# EAGLE design Enclosure 100x68 PBLPI (EAGLE 9.6.2)
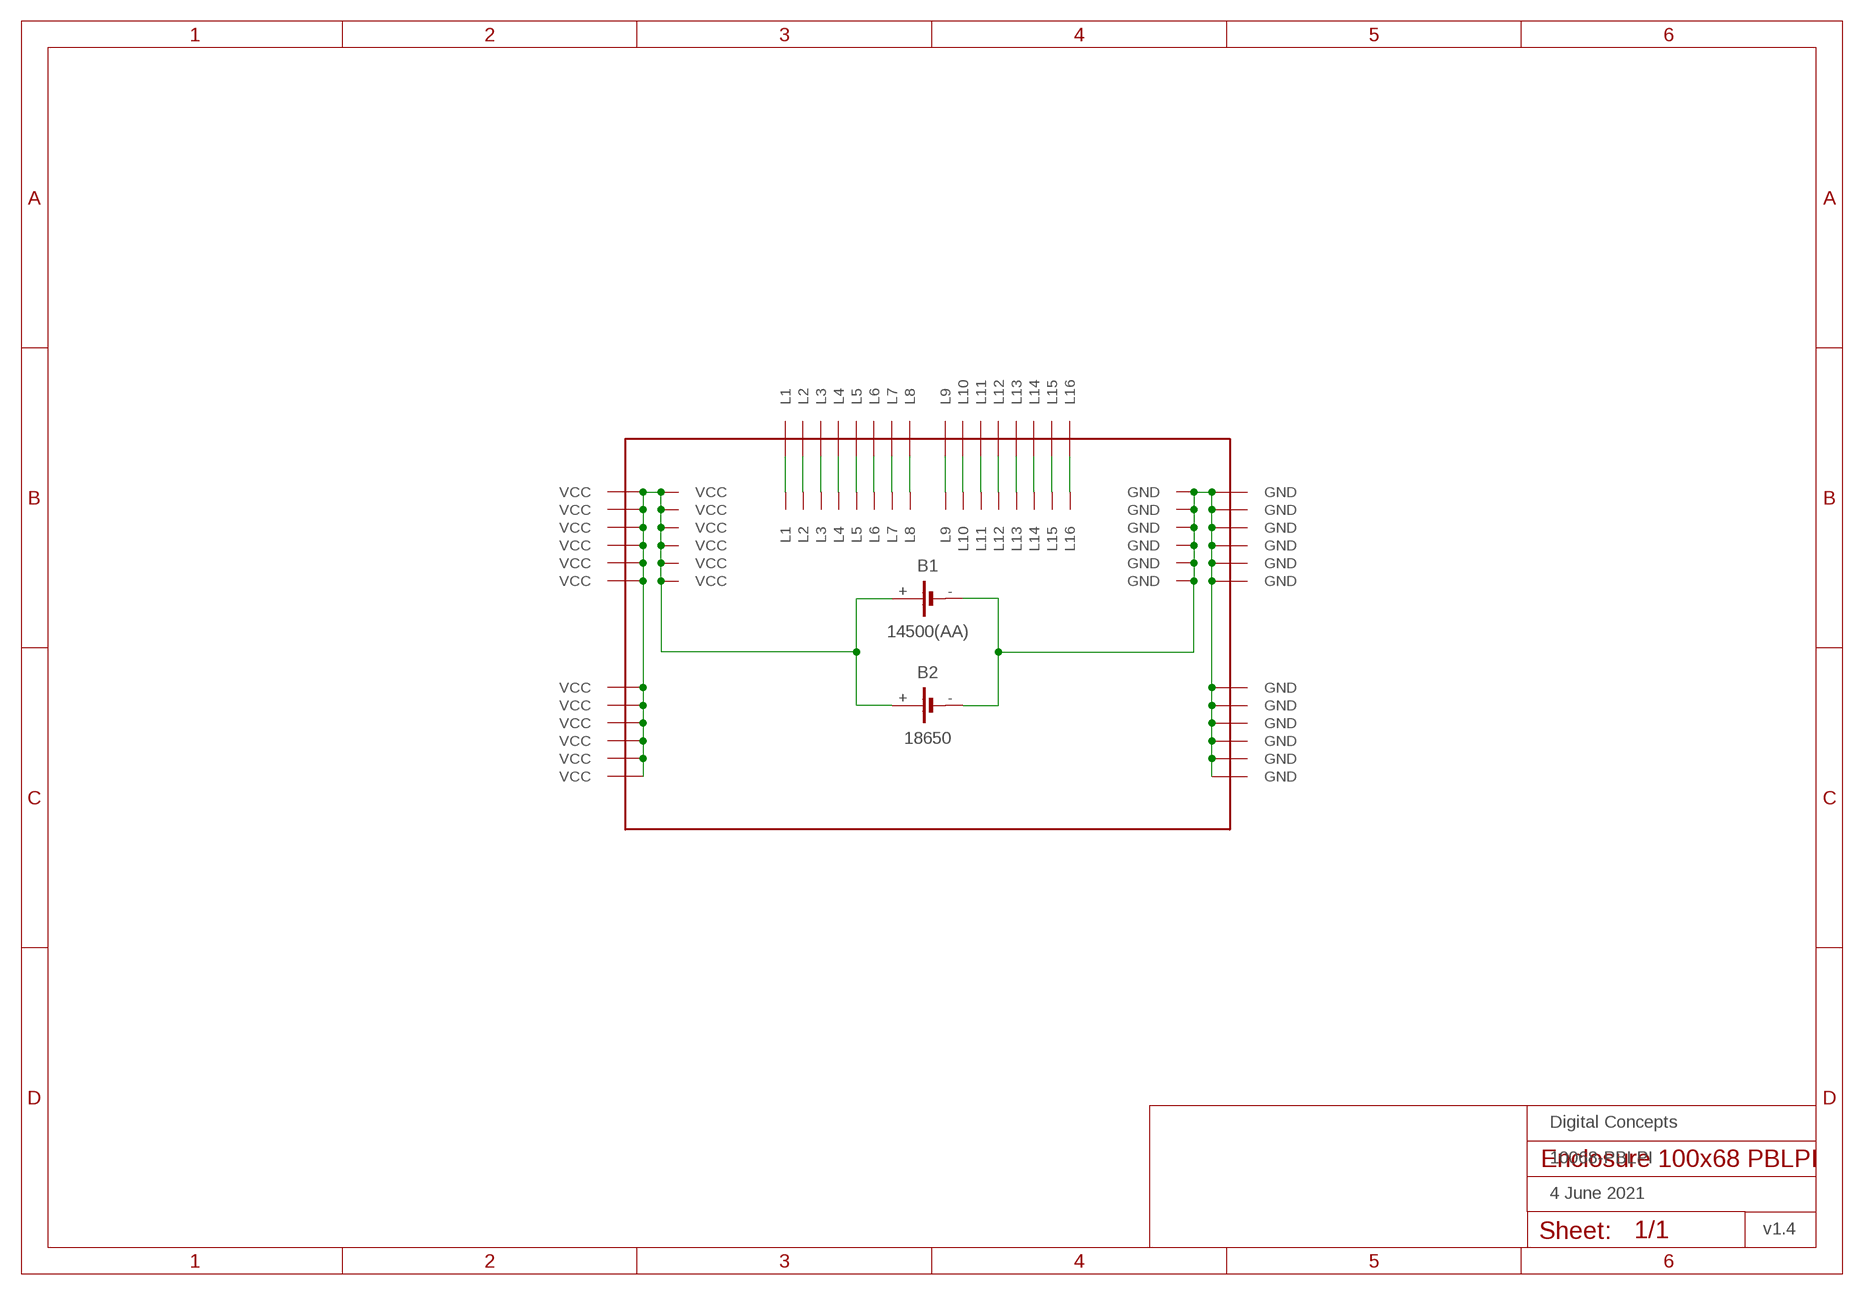
[diagram p0: schematic, sheet 1]
FRAME1 (FRAME-A4L-LOC): DATE: 4 June 2021; OWNER: Digital Concepts; TITLE: 10068-PBLPI; VERSION: v1.4

## Parts
B1  14500(AA)  BATTERY-HOLDER-14500(AA)  [BATTERY-14500]
B2  18650  BATTERY-HOLDER-18650  [BATTERY-18650]
P1  PROTO-34X22-BAT-PI  [PROTO-34X22-BAT-PI]

## Nets
GND: B1.- B2.- P1.P33-13(GND) P1.P33-14(GND) P1.P33-15(GND) P1.P33-16(GND) P1.P33-17(GND) P1.P33-18(GND) P1.P34-05(GND) P1.P34-06(GND) P1.P34-07(GND) P1.P34-08(GND) P1.P34-09(GND) P1.P34-10(GND) P1.P34-13(GND) P1.P34-14(GND) P1.P34-15(GND) P1.P34-16(GND) P1.P34-17(GND) P1.P34-18(GND)
N$1: P1.P10-21(L1) P1.P10-22(L1)
N$2: P1.P11-21(L2) P1.P11-22(L2)
N$3: P1.P12-21(L3) P1.P12-22(L3)
N$4: P1.P13-21(L4) P1.P13-22(L4)
N$5: P1.P14-21(L5) P1.P14-22(L5)
N$6: P1.P15-21(L6) P1.P15-22(L6)
N$7: P1.P16-21(L7) P1.P16-22(L7)
N$8: P1.P17-21(L8) P1.P17-22(L8)
N$9: P1.P18-21(L9) P1.P18-22(L9)
N$10: P1.P19-21(L10) P1.P19-22(L10)
N$11: P1.P20-21(L11) P1.P20-22(L11)
N$12: P1.P21-21(L12) P1.P21-22(L12)
N$13: P1.P22-21(L13) P1.P22-22(L13)
N$14: P1.P23-21(L14) P1.P23-22(L14)
N$15: P1.P24-21(L15) P1.P24-22(L15)
N$16: P1.P25-21(L16) P1.P25-22(L16)
VCC: B1.+ B2.+ P1.P01-05(VCC) P1.P01-06(VCC) P1.P01-07(VCC) P1.P01-08(VCC) P1.P01-09(VCC) P1.P01-10(VCC) P1.P01-13(VCC) P1.P01-14(VCC) P1.P01-15(VCC) P1.P01-16(VCC) P1.P01-17(VCC) P1.P01-18(VCC) P1.P02-13(VCC) P1.P02-14(VCC) P1.P02-15(VCC) P1.P02-16(VCC) P1.P02-17(VCC) P1.P02-18(VCC)

## Library data of the parts
B1 = digitalconcepts:BATTERY-HOLDER-14500(AA): 14500 (AA) battery holder
B2 = digitalconcepts:BATTERY-HOLDER-18650: 18650 Battery Holder
P1 = digitalconcepts:PROTO-34X22-BAT-PI: 34 x 22 Prototyping board, with battery connection (GND + Vcc plane), coupled side connection and Raspberry Pi Zero standoff mounting points, to fit a 100 x 68 enclosure

## Board
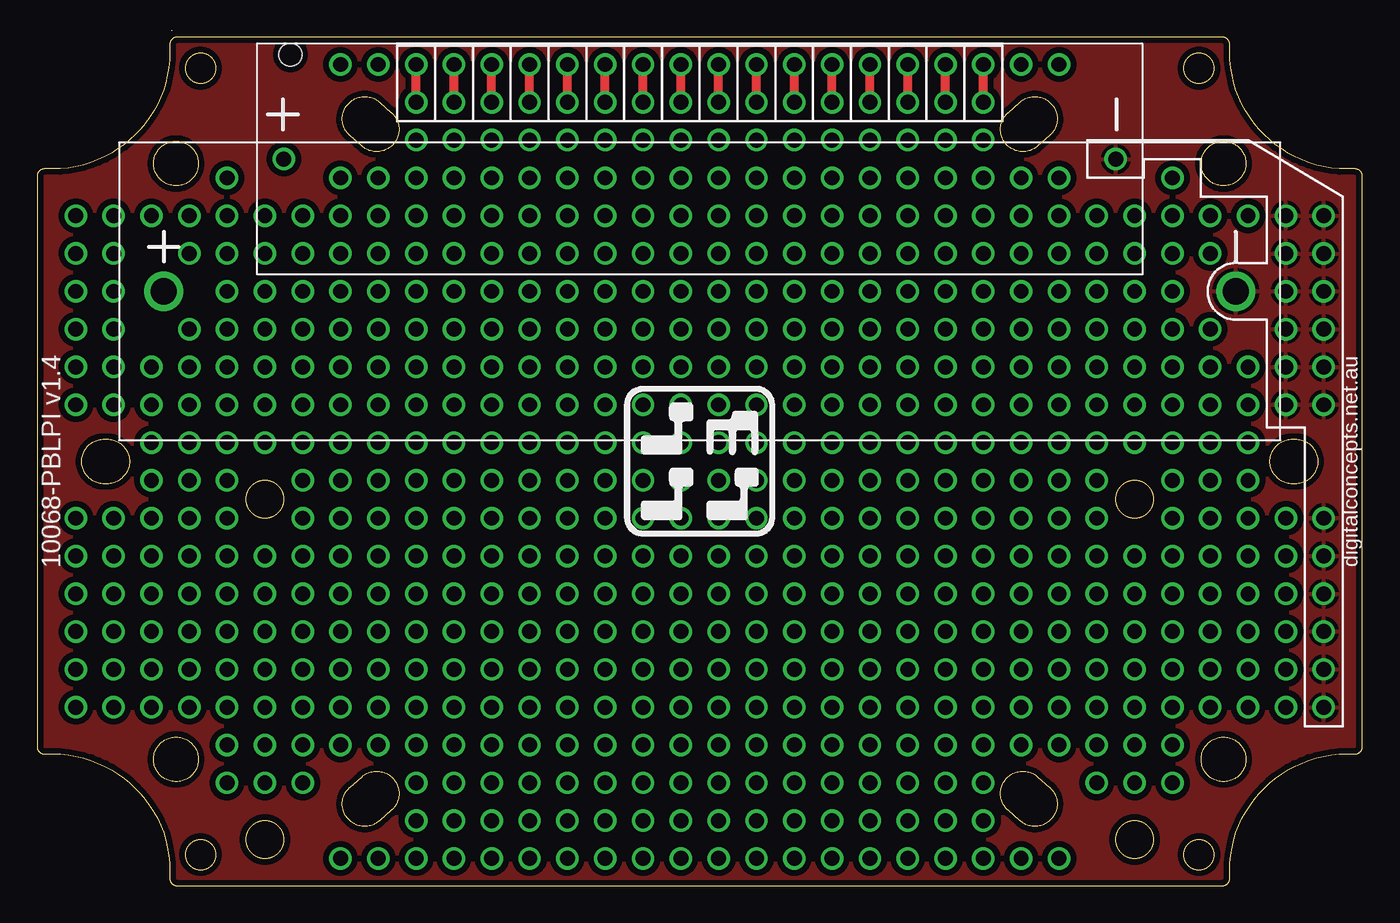
[diagram p1: board, top side]
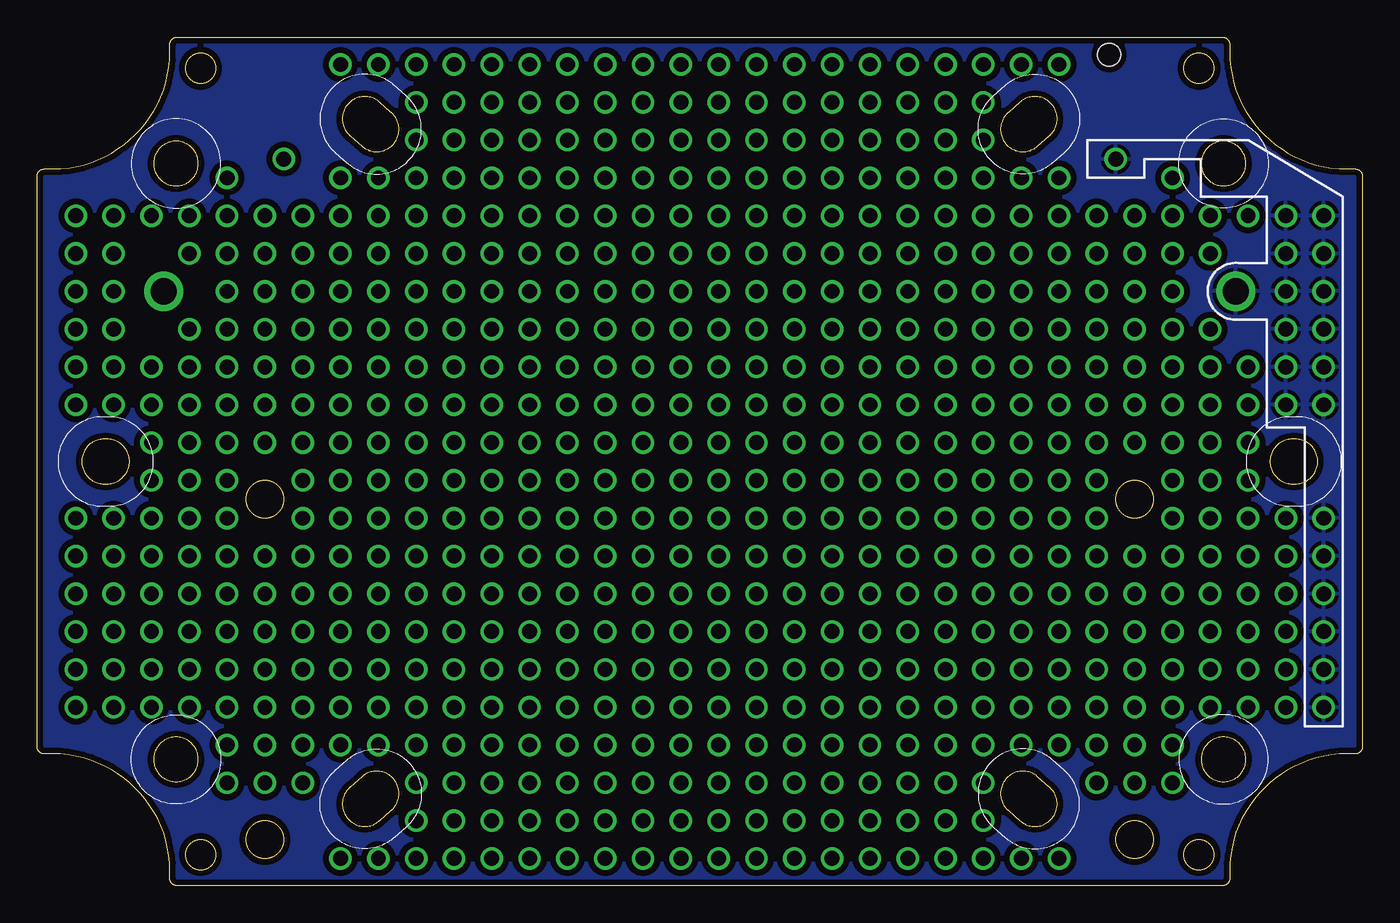
[diagram p2: board, bottom side, seen from below]

Size 89 x 57 mm. Coordinates in mm from the lower left corner, seen from the top.
Outline: 23.78,51.94 22.98,52.64 22.98,52.64 22.94,52.68 22.89,52.72 22.83,52.76 22.75,52.81 22.67,52.86 22.58,52.89 22.49,52.93 22.4,52.96 22.3,52.98 22.2,53 22.1,53.01 21.89,53.01 21.79,53 21.69,52.98 21.6,52.96 21.5,52.93 21.41,52.89 21.32,52.86 21.24,52.81 21.16,52.76 21.08,52.7 21,52.64 20.93,52.57 20.87,52.5 20.81,52.43 20.75,52.35 20.7,52.27 20.65,52.19 20.61,52.1 20.58,52.01 20.55,51.91 20.53,51.81 20.51,51.72 20.5,51.62 20.5,51.41 20.51,51.31 20.53,51.21 20.55,51.11 20.58,51.02 20.61,50.93 20.65,50.84 20.7,50.75 20.75,50.67 20.81,50.59 20.87,50.52 20.93,50.45 20.96,50.43 20.98,50.41 21.01,50.38 21.01,50.38 21.81,49.68 21.81,49.68 21.86,49.64 21.91,49.6 21.96,49.57 22.04,49.51 22.12,49.47 22.21,49.43 22.3,49.39 22.4,49.36 22.49,49.34 22.59,49.32 22.69,49.31 22.9,49.31 23,49.32 23.1,49.34 23.2,49.36 23.29,49.39 23.38,49.43 23.47,49.47 23.55,49.51 23.63,49.57 23.71,49.62 23.79,49.68 23.86,49.75 23.92,49.82 23.99,49.89 24.04,49.97 24.09,50.05 24.14,50.14 24.18,50.23 24.22,50.32 24.25,50.41 24.26,50.51 24.28,50.61 24.3,50.71 24.3,50.92 24.28,51.02 24.26,51.11 24.25,51.21 24.22,51.31 24.18,51.4 24.14,51.48 24.09,51.57 24.04,51.65 23.99,51.73 23.92,51.8 23.83,51.9 23.81,51.92 23.78,51.94
Outline: 23.78,51.94 23.78,51.94
Outline: 23.78,5.06 23.81,5.08 23.83,5.1 23.86,5.13 23.92,5.19 23.99,5.27 24.04,5.35 24.09,5.43 24.14,5.51 24.18,5.6 24.22,5.69 24.25,5.79 24.27,5.88 24.29,5.98 24.3,6.08 24.3,6.29 24.29,6.39 24.27,6.49 24.25,6.59 24.22,6.68 24.18,6.77 24.14,6.86 24.09,6.95 24.04,7.03 23.99,7.11 23.92,7.18 23.86,7.25 23.79,7.32 23.71,7.38 23.63,7.43 23.55,7.49 23.47,7.53 23.38,7.57 23.29,7.61 23.2,7.64 23.1,7.66 23,7.68 22.9,7.69 22.69,7.69 22.59,7.68 22.49,7.66 22.4,7.64 22.3,7.61 22.21,7.57 22.12,7.53 22.04,7.49 21.96,7.43 21.91,7.4 21.86,7.36 21.81,7.32 21.81,7.32 21.01,6.62 21.01,6.61 20.98,6.59 20.96,6.57 20.93,6.55 20.87,6.48 20.81,6.41 20.75,6.33 20.7,6.25 20.65,6.16 20.61,6.07 20.58,5.98 20.55,5.89 20.53,5.79 20.51,5.69 20.5,5.59 20.5,5.38 20.51,5.28 20.55,5.09 20.58,4.99 20.61,4.9 20.65,4.81 20.7,4.73 20.75,4.65 20.81,4.57 20.87,4.49 20.93,4.43 21,4.36 21.08,4.3 21.16,4.24 21.24,4.19 21.32,4.14 21.41,4.1 21.5,4.07 21.6,4.04 21.69,4.02 21.79,4 21.89,3.99 22.1,3.99 22.2,4 22.3,4.02 22.4,4.04 22.49,4.07 22.58,4.1 22.67,4.14 22.75,4.19 22.83,4.24 22.89,4.28 22.94,4.32 22.98,4.36 22.98,4.36 23.78,5.06
Outline: 23.78,5.06 23.78,5.06
Outline: 67.99,6.62 67.19,7.32 67.19,7.32 67.14,7.36 67.09,7.4 67.04,7.43 66.96,7.49 66.88,7.53 66.79,7.57 66.7,7.61 66.6,7.64 66.51,7.66 66.41,7.68 66.31,7.69 66.1,7.69 66,7.68 65.9,7.66 65.8,7.64 65.71,7.61 65.62,7.57 65.53,7.53 65.44,7.49 65.36,7.43 65.29,7.38 65.21,7.32 65.14,7.25 65.07,7.18 65.01,7.11 64.96,7.03 64.91,6.95 64.86,6.86 64.82,6.77 64.78,6.68 64.75,6.59 64.73,6.49 64.71,6.39 64.7,6.29 64.7,6.08 64.71,5.98 64.73,5.89 64.75,5.79 64.78,5.69 64.82,5.6 64.86,5.51 64.91,5.43 64.96,5.35 65.01,5.27 65.07,5.19 65.14,5.13 65.17,5.1 65.19,5.08 65.22,5.06 65.22,5.06 66.02,4.36 66.02,4.36 66.07,4.32 66.11,4.28 66.17,4.24 66.25,4.19 66.33,4.14 66.42,4.1 66.51,4.07 66.6,4.04 66.7,4.02 66.8,4 66.9,3.99 67.11,3.99 67.21,4 67.31,4.02 67.4,4.04 67.5,4.07 67.59,4.1 67.68,4.14 67.76,4.19 67.84,4.24 67.92,4.3 68,4.36 68.06,4.43 68.13,4.49 68.19,4.57 68.25,4.65 68.3,4.73 68.35,4.81 68.39,4.9 68.42,4.99 68.45,5.09 68.47,5.19 68.49,5.28 68.5,5.38 68.5,5.59 68.49,5.69 68.47,5.79 68.45,5.89 68.42,5.98 68.39,6.07 68.35,6.16 68.3,6.25 68.25,6.33 68.19,6.41 68.13,6.48 68.06,6.55 68.04,6.57 68.02,6.59 67.99,6.62
Outline: 67.99,6.62 67.99,6.62
Outline: 88.99,47.76 88.98,47.79 88.97,47.83 88.96,47.86 88.95,47.88 88.93,47.91 88.92,47.94 88.9,47.96 88.88,47.99 88.86,48.01 88.83,48.03 88.81,48.05 88.78,48.07 88.76,48.09 88.73,48.1 88.7,48.12 88.67,48.13 88.64,48.14 88.61,48.14 88.57,48.15 88.54,48.15 87.46,48.15 86.93,48.21 86.42,48.31 85.9,48.42 85.4,48.57 84.93,48.77 84.46,48.97 84.01,49.22 83.59,49.5 83.17,49.78 82.77,50.1 82.42,50.46 82.06,50.81 81.74,51.2 81.45,51.62 81.17,52.04 80.92,52.49 80.52,53.43 80.37,53.92 80.26,54.43 80.15,54.94 80.1,55.47 80.1,56.54 80.1,56.58 80.09,56.61 80.08,56.64 80.07,56.67 80.06,56.7 80.05,56.73 80.03,56.76 80.02,56.78 80,56.81 79.98,56.83 79.96,56.86 79.93,56.88 79.91,56.9 79.88,56.92 79.86,56.93 79.83,56.95 79.8,56.96 79.77,56.97 79.74,56.98 79.7,56.99 79.67,57 79.64,57 9.36,57 9.33,57 9.3,56.99 9.26,56.98 9.23,56.97 9.2,56.96 9.17,56.95 9.14,56.93 9.12,56.92 9.09,56.9 9.07,56.88 9.02,56.83 9,56.81 8.98,56.78 8.97,56.76 8.95,56.73 8.94,56.7 8.93,56.67 8.92,56.64 8.91,56.61 8.9,56.58 8.9,56.54 8.9,55.47 8.84,54.94 8.74,54.43 8.63,53.92 8.48,53.43 8.28,52.96 8.08,52.49 7.83,52.04 7.55,51.62 7.26,51.2 6.94,50.81 6.58,50.46 6.22,50.1 5.83,49.78 5.41,49.5 4.99,49.22 4.54,48.97 4.07,48.77 3.59,48.57 3.1,48.42 2.58,48.31 2.07,48.21 1.54,48.15 0.46,48.15 0.43,48.15 0.39,48.14 0.36,48.14 0.33,48.13 0.3,48.12 0.27,48.1 0.24,48.09 0.22,48.07 0.19,48.05 0.17,48.03 0.14,48.01 0.12,47.99 0.1,47.96 0.08,47.94 0.07,47.91 0.05,47.88 0.04,47.86 0.03,47.83 0.02,47.79 0.01,47.76 0,47.73 0,47.7 0,9.3 0,9.27 0.01,9.24 0.02,9.2 0.03,9.17 0.04,9.14 0.05,9.11 0.07,9.09 0.08,9.06 0.1,9.03 0.12,9.01 0.14,8.99 0.17,8.97 0.19,8.95 0.22,8.93 0.24,8.91 0.27,8.9 0.3,8.88 0.33,8.87 0.36,8.86 0.39,8.85 0.43,8.85 0.46,8.84 1.54,8.84 2.07,8.79 2.58,8.68 3.1,8.58 3.59,8.43 4.07,8.23 4.54,8.03 4.99,7.78 5.41,7.5 5.83,7.22 6.22,6.9 6.58,6.54 6.94,6.19 7.26,5.8 7.55,5.38 7.83,4.96 8.08,4.51 8.28,4.04 8.48,3.57 8.63,3.08 8.74,2.57 8.84,2.06 8.9,1.53 8.9,0.46 8.9,0.42 8.91,0.39 8.92,0.36 8.93,0.33 8.94,0.3 8.95,0.27 8.97,0.24 8.98,0.22 9,0.19 9.02,0.17 9.04,0.14 9.07,0.12 9.09,0.1 9.12,0.08 9.14,0.07 9.17,0.05 9.2,0.04 9.23,0.03 9.26,0.02 9.29,0.01 9.33,0 9.36,0 79.64,0 79.67,0 79.7,0.01 79.74,0.02 79.77,0.03 79.8,0.04 79.83,0.05 79.86,0.07 79.88,0.08 79.91,0.1 79.93,0.12 79.96,0.14 79.98,0.17 80,0.19 80.02,0.22 80.03,0.24 80.05,0.27 80.06,0.3 80.07,0.33 80.08,0.36 80.09,0.39 80.1,0.42 80.1,0.46 80.1,1.53 80.15,2.06 80.26,2.57 80.37,3.08 80.52,3.57 80.92,4.51 81.17,4.96 81.45,5.38 81.74,5.8 82.06,6.19 82.42,6.54 82.77,6.9 83.17,7.22 83.59,7.5 84.01,7.78 84.46,8.03 84.93,8.23 85.4,8.43 85.9,8.58 86.42,8.68 86.93,8.79 87.46,8.84 88.54,8.84 88.57,8.85 88.61,8.85 88.64,8.86 88.67,8.87 88.7,8.88 88.73,8.9 88.76,8.91 88.78,8.93 88.81,8.95 88.83,8.97 88.86,8.99 88.88,9.01 88.9,9.04 88.92,9.06 88.93,9.09 88.95,9.12 88.96,9.15 88.97,9.17 88.98,9.21 88.99,9.24 89,9.27 89,9.3 89,47.7 89,47.73 88.99,47.76
Outline: 6.16,28.2 6.14,28.1 6.12,28.01 6.08,27.92 6.04,27.83 5.99,27.74 5.94,27.66 5.88,27.58 5.82,27.51 5.76,27.44 5.69,27.37 5.61,27.31 5.53,27.26 5.45,27.2 5.37,27.16 5.28,27.12 5.19,27.08 5.09,27.05 5,27.03 4.9,27.01 4.8,27 4.39,27 4.29,27.01 4.19,27.03 4.09,27.05 4,27.08 3.91,27.12 3.82,27.16 3.74,27.2 3.66,27.26 3.58,27.31 3.5,27.37 3.43,27.44 3.37,27.51 3.3,27.58 3.25,27.66 3.2,27.74 3.15,27.83 3.11,27.92 3.07,28.01 3.04,28.1 3.02,28.2 3.01,28.3 2.99,28.4 2.99,28.6 3.01,28.7 3.02,28.8 3.04,28.9 3.07,28.99 3.15,29.17 3.2,29.26 3.25,29.34 3.3,29.42 3.37,29.49 3.43,29.56 3.5,29.63 3.58,29.69 3.66,29.74 3.74,29.8 3.82,29.84 3.91,29.88 4,29.92 4.09,29.95 4.19,29.97 4.29,29.99 4.39,30 4.8,30 4.9,29.99 5,29.97 5.09,29.95 5.19,29.92 5.28,29.88 5.37,29.84 5.45,29.8 5.53,29.74 5.61,29.69 5.69,29.63 5.76,29.56 5.82,29.49 5.88,29.42 5.94,29.34 5.99,29.26 6.04,29.17 6.08,29.08 6.12,28.99 6.14,28.9 6.16,28.8 6.18,28.7 6.19,28.6 6.19,28.4 6.18,28.3 6.16,28.2
Outline: 10.79,8.18 10.77,8.09 10.74,7.99 10.7,7.9 10.66,7.81 10.62,7.73 10.56,7.65 10.51,7.57 10.45,7.49 10.38,7.42 10.31,7.36 10.24,7.3 10.16,7.24 10.08,7.19 9.99,7.14 9.9,7.1 9.81,7.06 9.72,7.03 9.62,7.01 9.53,6.99 9.42,6.98 9.22,6.98 9.12,6.99 9.02,7.01 8.92,7.03 8.83,7.06 8.74,7.1 8.65,7.14 8.56,7.19 8.48,7.24 8.4,7.3 8.33,7.36 8.26,7.42 8.19,7.49 8.13,7.57 8.08,7.65 8.02,7.73 7.98,7.81 7.94,7.9 7.9,7.99 7.87,8.09 7.85,8.18 7.83,8.28 7.82,8.38 7.82,8.59 7.83,8.69 7.85,8.79 7.87,8.88 7.9,8.98 7.94,9.07 7.98,9.16 8.02,9.24 8.08,9.32 8.13,9.4 8.19,9.48 8.26,9.55 8.33,9.61 8.4,9.67 8.48,9.73 8.56,9.78 8.65,9.83 8.74,9.87 8.83,9.9 8.92,9.93 9.02,9.95 9.12,9.97 9.22,9.98 9.42,9.98 9.53,9.97 9.62,9.95 9.72,9.93 9.81,9.9 9.9,9.87 9.99,9.83 10.08,9.78 10.16,9.73 10.24,9.67 10.31,9.61 10.38,9.55 10.45,9.48 10.51,9.4 10.56,9.32 10.62,9.24 10.66,9.16 10.7,9.07 10.74,8.98 10.77,8.88 10.79,8.79 10.81,8.69 10.82,8.59 10.82,8.38 10.81,8.28 10.79,8.18
Outline: 10.79,48.21 10.77,48.11 10.74,48.02 10.7,47.93 10.66,47.84 10.62,47.76 10.56,47.68 10.51,47.6 10.45,47.52 10.38,47.45 10.31,47.39 10.24,47.32 10.16,47.27 10.08,47.22 9.99,47.17 9.9,47.13 9.81,47.09 9.72,47.06 9.62,47.04 9.53,47.03 9.42,47.01 9.22,47.01 9.12,47.03 9.02,47.04 8.92,47.06 8.83,47.09 8.74,47.13 8.65,47.17 8.56,47.22 8.48,47.27 8.4,47.32 8.33,47.39 8.26,47.45 8.19,47.52 8.13,47.6 8.08,47.68 8.02,47.76 7.98,47.84 7.94,47.93 7.9,48.02 7.87,48.11 7.85,48.21 7.83,48.31 7.82,48.41 7.82,48.62 7.83,48.72 7.85,48.82 7.87,48.91 7.9,49.01 7.94,49.1 7.98,49.19 8.02,49.27 8.08,49.35 8.13,49.43 8.19,49.51 8.26,49.58 8.33,49.64 8.4,49.7 8.48,49.76 8.56,49.81 8.65,49.86 8.74,49.9 8.83,49.93 8.92,49.96 9.02,49.98 9.12,50 9.22,50.01 9.42,50.01 9.53,50 9.62,49.98 9.72,49.96 9.81,49.93 9.9,49.9 9.99,49.86 10.08,49.81 10.16,49.76 10.24,49.7 10.31,49.64 10.38,49.58 10.45,49.51 10.51,49.43 10.56,49.35 10.62,49.27 10.66,49.19 10.7,49.1 10.74,49.01 10.77,48.91 10.79,48.82 10.81,48.72 10.82,48.62 10.82,48.41 10.81,48.31 10.79,48.21
Outline: 64.73,51.11 64.75,51.21 64.78,51.31 64.82,51.4 64.86,51.49 64.91,51.57 64.96,51.65 65.01,51.73 65.08,51.8 65.14,51.87 65.17,51.9 65.19,51.92 65.22,51.94 65.22,51.94 66.02,52.64 66.02,52.64 66.06,52.68 66.11,52.72 66.17,52.76 66.25,52.81 66.33,52.86 66.42,52.89 66.51,52.93 66.6,52.96 66.7,52.98 66.8,53 66.9,53.01 67.11,53.01 67.21,53 67.31,52.98 67.4,52.96 67.5,52.93 67.59,52.89 67.68,52.86 67.76,52.81 67.84,52.76 67.92,52.7 68,52.64 68.06,52.57 68.13,52.5 68.19,52.43 68.25,52.35 68.3,52.27 68.35,52.19 68.39,52.1 68.42,52.01 68.45,51.91 68.47,51.81 68.49,51.72 68.5,51.62 68.5,51.41 68.49,51.31 68.47,51.21 68.45,51.11 68.42,51.02 68.39,50.93 68.35,50.84 68.3,50.75 68.25,50.67 68.19,50.59 68.13,50.52 68.06,50.45 68.04,50.43 68.02,50.41 67.99,50.38 67.99,50.38 67.19,49.68 67.19,49.68 67.14,49.64 67.09,49.6 67.04,49.57 66.96,49.51 66.88,49.47 66.79,49.43 66.7,49.39 66.6,49.36 66.51,49.34 66.41,49.32 66.31,49.31 66.1,49.31 66,49.32 65.9,49.34 65.8,49.36 65.71,49.39 65.62,49.43 65.53,49.47 65.45,49.51 65.37,49.57 65.29,49.62 65.21,49.68 65.14,49.75 65.08,49.82 65.01,49.89 64.96,49.97 64.91,50.05 64.86,50.14 64.82,50.23 64.78,50.32 64.75,50.41 64.73,50.51 64.71,50.61 64.7,50.71 64.7,50.92 64.71,51.02 64.73,51.11
Outline: 81.15,8.18 81.13,8.09 81.1,7.99 81.06,7.9 81.02,7.81 80.98,7.73 80.92,7.65 80.87,7.57 80.81,7.49 80.74,7.42 80.67,7.36 80.6,7.3 80.52,7.24 80.44,7.19 80.35,7.14 80.26,7.1 80.17,7.06 80.08,7.03 79.98,7.01 79.88,6.99 79.78,6.98 79.58,6.98 79.47,6.99 79.38,7.01 79.28,7.03 79.18,7.06 79.1,7.1 79,7.14 78.92,7.19 78.84,7.24 78.76,7.3 78.69,7.36 78.62,7.42 78.55,7.49 78.49,7.57 78.43,7.65 78.38,7.73 78.33,7.81 78.3,7.9 78.26,7.99 78.23,8.09 78.21,8.18 78.19,8.28 78.18,8.38 78.18,8.59 78.19,8.69 78.21,8.79 78.23,8.88 78.26,8.98 78.3,9.07 78.33,9.16 78.38,9.24 78.43,9.32 78.49,9.4 78.55,9.48 78.62,9.55 78.69,9.61 78.76,9.67 78.84,9.73 78.92,9.78 79,9.83 79.1,9.87 79.18,9.9 79.28,9.93 79.38,9.95 79.47,9.97 79.58,9.98 79.78,9.98 79.88,9.97 79.98,9.95 80.08,9.93 80.17,9.9 80.26,9.87 80.35,9.83 80.44,9.78 80.52,9.73 80.6,9.67 80.67,9.61 80.74,9.55 80.81,9.48 80.87,9.4 80.92,9.32 80.98,9.24 81.02,9.16 81.06,9.07 81.1,8.98 81.13,8.88 81.15,8.79 81.17,8.69 81.18,8.59 81.18,8.38 81.17,8.28 81.15,8.18
Outline: 81.15,48.21 81.13,48.11 81.1,48.02 81.06,47.93 81.02,47.84 80.98,47.76 80.92,47.68 80.87,47.6 80.81,47.52 80.74,47.45 80.67,47.39 80.6,47.32 80.52,47.27 80.44,47.22 80.35,47.17 80.26,47.13 80.17,47.09 80.08,47.07 79.98,47.05 79.88,47.03 79.78,47.01 79.58,47.01 79.47,47.03 79.38,47.05 79.28,47.07 79.18,47.09 79.1,47.13 79,47.17 78.92,47.22 78.84,47.27 78.76,47.32 78.69,47.39 78.62,47.45 78.55,47.52 78.49,47.6 78.43,47.68 78.38,47.76 78.33,47.84 78.3,47.93 78.26,48.02 78.23,48.11 78.21,48.21 78.19,48.31 78.18,48.41 78.18,48.62 78.19,48.72 78.21,48.82 78.23,48.91 78.26,49.01 78.3,49.1 78.33,49.19 78.38,49.27 78.43,49.35 78.49,49.43 78.55,49.51 78.62,49.57 78.69,49.64 78.76,49.7 78.84,49.76 78.92,49.81 79,49.86 79.1,49.9 79.18,49.93 79.28,49.96 79.38,49.98 79.47,50 79.58,50.01 79.78,50.01 79.88,50 79.98,49.98 80.08,49.96 80.17,49.93 80.26,49.9 80.35,49.86 80.44,49.81 80.52,49.76 80.6,49.7 80.67,49.64 80.74,49.57 80.81,49.51 80.87,49.43 80.92,49.35 80.98,49.27 81.02,49.19 81.06,49.1 81.1,49.01 81.13,48.91 81.15,48.82 81.17,48.72 81.18,48.62 81.18,48.41 81.17,48.31 81.15,48.21
Outline: 85.97,28.2 85.95,28.1 85.93,28.01 85.89,27.92 85.85,27.83 85.8,27.74 85.75,27.66 85.69,27.58 85.63,27.51 85.57,27.44 85.5,27.37 85.42,27.31 85.34,27.26 85.26,27.2 85.18,27.16 85.09,27.12 85,27.08 84.9,27.05 84.81,27.03 84.71,27.01 84.61,27 84.2,27 84.1,27.01 84,27.03 83.9,27.05 83.81,27.08 83.72,27.12 83.63,27.16 83.55,27.2 83.47,27.26 83.39,27.31 83.31,27.37 83.24,27.44 83.18,27.51 83.11,27.58 83.06,27.66 83.01,27.74 82.96,27.83 82.92,27.92 82.88,28.01 82.85,28.1 82.83,28.2 82.82,28.3 82.8,28.4 82.8,28.6 82.82,28.7 82.83,28.8 82.85,28.9 82.88,28.99 82.92,29.08 82.96,29.17 83.01,29.26 83.06,29.34 83.11,29.42 83.18,29.49 83.24,29.56 83.31,29.63 83.39,29.69 83.47,29.74 83.55,29.8 83.63,29.84 83.72,29.88 83.81,29.92 83.9,29.95 84,29.97 84.1,29.99 84.2,30 84.61,30 84.71,29.99 84.81,29.97 84.9,29.95 85,29.92 85.09,29.88 85.18,29.84 85.26,29.8 85.34,29.74 85.42,29.69 85.5,29.63 85.57,29.56 85.63,29.49 85.69,29.42 85.75,29.34 85.8,29.26 85.85,29.17 85.89,29.08 85.93,28.99 85.95,28.9 85.97,28.8 85.99,28.7 86,28.6 86,28.4 85.99,28.3 85.97,28.2
Outline: circle at 15.29,25.96 radius 1.27
Outline: circle at 15.29,3.1 radius 1.27
Outline: circle at 73.71,3.1 radius 1.27
Outline: circle at 73.71,25.96 radius 1.27
Outline: circle at 10.97,54.92 radius 1.02
Outline: circle at 10.97,2.08 radius 1.02
Outline: circle at 78.03,2.08 radius 1.02
Outline: circle at 78.03,54.92 radius 1.02
Copper layers (1*16): Top 0.035mm / dielectric 1.5mm / Bottom 0.035mm
Design rules "default *": minimum track width 6mil, minimum drill 0.35mm, track to track 6mil, track to pad 6mil, pad to pad 6mil, via to via 6mil, smd to smd 6mil, copper to edge 6mil, drill to drill 6mil, minimum pad ring 10mil, minimum via ring 8mil, stop-mask expansion 4mil, vias tented up to drill 0mil, thermal gap 10mil

### Footprints (pad centres in the part's own frame; a part is rotated, then mirrored left to right if it is on the bottom)
BATTERY-14500 = drill 1: + -27.94,0; - 27.94,0 | hole 1.524: -27.5,7
BATTERY-18650 = drill 1.75: + -36,0; - 36,0
PROTO-34X22-BAT-PI = drill 1: P01-05 -39.37,-13.97; P01-06 -39.37,-11.43; P01-07 -39.37,-8.89; P01-08 -39.37,-6.35; P01-09 -39.37,-3.81; P01-10 -39.37,-1.27; P01-13 -39.37,6.35; P01-14 -39.37,8.89; P01-15 -39.37,11.43; P01-16 -39.37,13.97; P01-17 -39.37,16.51; P01-18 -39.37,19.05; P02-05 -36.83,-13.97; P02-06 -36.83,-11.43; P02-07 -36.83,-8.89; P02-08 -36.83,-6.35; P02-09 -36.83,-3.81; P02-10 -36.83,-1.27; P02-13 -36.83,6.35; P02-14 -36.83,8.89; P02-15 -36.83,11.43; P02-16 -36.83,13.97; P02-17 -36.83,16.51; P02-18 -36.83,19.05; P03-05 -34.29,-13.97; P03-06 -34.29,-11.43; P03-07 -34.29,-8.89; P03-08 -34.29,-6.35; P03-09 -34.29,-3.81; P03-10 -34.29,-1.27; P03-11 -34.29,1.27; P03-12 -34.29,3.81; P03-13 -34.29,6.35; P03-14 -34.29,8.89; P03-18 -34.29,19.05; P04-05 -31.75,-13.97; P04-06 -31.75,-11.43; P04-07 -31.75,-8.89; P04-08 -31.75,-6.35; P04-09 -31.75,-3.81; P04-10 -31.75,-1.27; P04-11 -31.75,1.27; P04-12 -31.75,3.81; P04-13 -31.75,6.35; P04-14 -31.75,8.89; P04-15 -31.75,11.43; P04-17 -31.75,16.51; P04-18 -31.75,19.05; P05-03 -29.21,-19.05; P05-04 -29.21,-16.51; P05-05 -29.21,-13.97; P05-06 -29.21,-11.43; P05-07 -29.21,-8.89; P05-08 -29.21,-6.35; P05-09 -29.21,-3.81; P05-10 -29.21,-1.27; P05-11 -29.21,1.27; P05-12 -29.21,3.81; P05-13 -29.21,6.35; P05-14 -29.21,8.89; P05-15 -29.21,11.43; P05-16 -29.21,13.97; P05-17 -29.21,16.51; P05-18 -29.21,19.05; P05-19 -29.21,21.59; P06-03 -26.67,-19.05; P06-04 -26.67,-16.51; P06-05 -26.67,-13.97; P06-06 -26.67,-11.43; P06-07 -26.67,-8.89; P06-08 -26.67,-6.35; P06-09 -26.67,-3.81; P06-12 -26.67,3.81; P06-13 -26.67,6.35; P06-14 -26.67,8.89; P06-15 -26.67,11.43; P06-16 -26.67,13.97; P06-17 -26.67,16.51; P06-18 -26.67,19.05; P07-03 -24.13,-19.05; P07-04 -24.13,-16.51; P07-05 -24.13,-13.97; P07-06 -24.13,-11.43; P07-07 -24.13,-8.89; P07-08 -24.13,-6.35; P07-09 -24.13,-3.81; P07-10 -24.13,-1.27; P07-11 -24.13,1.27; P07-12 -24.13,3.81; P07-13 -24.13,6.35; P07-14 -24.13,8.89; P07-15 -24.13,11.43; P07-16 -24.13,13.97; P07-17 -24.13,16.51; P07-18 -24.13,19.05; P08-01 -21.59,-24.13; P08-04 -21.59,-16.51; P08-05 -21.59,-13.97; P08-06 -21.59,-11.43; P08-07 -21.59,-8.89; P08-08 -21.59,-6.35; P08-09 -21.59,-3.81; P08-10 -21.59,-1.27; P08-11 -21.59,1.27; P08-12 -21.59,3.81; P08-13 -21.59,6.35; P08-14 -21.59,8.89; P08-15 -21.59,11.43; P08-16 -21.59,13.97; P08-17 -21.59,16.51; P08-18 -21.59,19.05; P08-19 -21.59,21.59; P08-22 -21.59,29.21; P09-01 -19.05,-24.13; P09-04 -19.05,-16.51; P09-05 -19.05,-13.97; P09-06 -19.05,-11.43; P09-07 -19.05,-8.89; P09-08 -19.05,-6.35; P09-09 -19.05,-3.81; P09-10 -19.05,-1.27; P09-11 -19.05,1.27; P09-12 -19.05,3.81; P09-13 -19.05,6.35; P09-14 -19.05,8.89; P09-15 -19.05,11.43; P09-16 -19.05,13.97; P09-17 -19.05,16.51; P09-18 -19.05,19.05; P09-19 -19.05,21.59; P09-22 -19.05,29.21; P10-01 -16.51,-24.13; P10-02 -16.51,-21.59; P10-03 -16.51,-19.05; P10-04 -16.51,-16.51; P10-05 -16.51,-13.97; P10-06 -16.51,-11.43; P10-07 -16.51,-8.89; P10-08 -16.51,-6.35; P10-09 -16.51,-3.81; P10-10 -16.51,-1.27; P10-11 -16.51,1.27; P10-12 -16.51,3.81; P10-13 -16.51,6.35; P10-14 -16.51,8.89; P10-15 -16.51,11.43; P10-16 -16.51,13.97; P10-17 -16.51,16.51; P10-18 -16.51,19.05; P10-19 -16.51,21.59; P10-20 -16.51,24.13; P10-21 -16.51,26.67; P10-22 -16.51,29.21; P11-01 -13.97,-24.13; P11-02 -13.97,-21.59; P11-03 -13.97,-19.05; P11-04 -13.97,-16.51; P11-05 -13.97,-13.97; P11-06 -13.97,-11.43; P11-07 -13.97,-8.89; P11-08 -13.97,-6.35; P11-09 -13.97,-3.81; P11-10 -13.97,-1.27; P11-11 -13.97,1.27; P11-12 -13.97,3.81; P11-13 -13.97,6.35; P11-14 -13.97,8.89; P11-15 -13.97,11.43; P11-16 -13.97,13.97; P11-17 -13.97,16.51; P11-18 -13.97,19.05; P11-19 -13.97,21.59; P11-20 -13.97,24.13; P11-21 -13.97,26.67; P11-22 -13.97,29.21; P12-01 -11.43,-24.13; P12-02 -11.43,-21.59; P12-03 -11.43,-19.05; P12-04 -11.43,-16.51; P12-05 -11.43,-13.97; P12-06 -11.43,-11.43; P12-07 -11.43,-8.89; P12-08 -11.43,-6.35; P12-09 -11.43,-3.81; P12-10 -11.43,-1.27; P12-11 -11.43,1.27; P12-12 -11.43,3.81; P12-13 -11.43,6.35; P12-14 -11.43,8.89; P12-15 -11.43,11.43; P12-16 -11.43,13.97; P12-17 -11.43,16.51; P12-18 -11.43,19.05; P12-19 -11.43,21.59; P12-20 -11.43,24.13; P12-21 -11.43,26.67; P12-22 -11.43,29.21; P13-01 -8.89,-24.13; P13-02 -8.89,-21.59; P13-03 -8.89,-19.05; P13-04 -8.89,-16.51; P13-05 -8.89,-13.97; P13-06 -8.89,-11.43; P13-07 -8.89,-8.89; P13-08 -8.89,-6.35; P13-09 -8.89,-3.81; P13-10 -8.89,-1.27; P13-11 -8.89,1.27; P13-12 -8.89,3.81; P13-13 -8.89,6.35; P13-14 -8.89,8.89; P13-15 -8.89,11.43; P13-16 -8.89,13.97; P13-17 -8.89,16.51; P13-18 -8.89,19.05; P13-19 -8.89,21.59; P13-20 -8.89,24.13; P13-21 -8.89,26.67; P13-22 -8.89,29.21; P14-01 -6.35,-24.13; P14-02 -6.35,-21.59; P14-03 -6.35,-19.05; P14-04 -6.35,-16.51; P14-05 -6.35,-13.97; P14-06 -6.35,-11.43; P14-07 -6.35,-8.89; P14-08 -6.35,-6.35; P14-09 -6.35,-3.81; P14-10 -6.35,-1.27; P14-11 -6.35,1.27; P14-12 -6.35,3.81; P14-13 -6.35,6.35; P14-14 -6.35,8.89; P14-15 -6.35,11.43; P14-16 -6.35,13.97; P14-17 -6.35,16.51; P14-18 -6.35,19.05; P14-19 -6.35,21.59; P14-20 -6.35,24.13; P14-21 -6.35,26.67; P14-22 -6.35,29.21; P15-01 -3.81,-24.13; P15-02 -3.81,-21.59; P15-03 -3.81,-19.05; P15-04 -3.81,-16.51; P15-05 -3.81,-13.97; P15-06 -3.81,-11.43; P15-07 -3.81,-8.89; P15-08 -3.81,-6.35; P15-09 -3.81,-3.81; P15-10 -3.81,-1.27; P15-11 -3.81,1.27; P15-12 -3.81,3.81; P15-13 -3.81,6.35; P15-14 -3.81,8.89; P15-15 -3.81,11.43; P15-16 -3.81,13.97; P15-17 -3.81,16.51; P15-18 -3.81,19.05; P15-19 -3.81,21.59; P15-20 -3.81,24.13; P15-21 -3.81,26.67; P15-22 -3.81,29.21; P16-01 -1.27,-24.13; P16-02 -1.27,-21.59; P16-03 -1.27,-19.05; P16-04 -1.27,-16.51; P16-05 -1.27,-13.97; P16-06 -1.27,-11.43; P16-07 -1.27,-8.89; P16-08 -1.27,-6.35; P16-09 -1.27,-3.81; P16-10 -1.27,-1.27; P16-11 -1.27,1.27; P16-12 -1.27,3.81; P16-13 -1.27,6.35; P16-14 -1.27,8.89; P16-15 -1.27,11.43; P16-16 -1.27,13.97; P16-17 -1.27,16.51; P16-18 -1.27,19.05; P16-19 -1.27,21.59; P16-20 -1.27,24.13; P16-21 -1.27,26.67; P16-22 -1.27,29.21; P17-01 1.27,-24.13; P17-02 1.27,-21.59; P17-03 1.27,-19.05; P17-04 1.27,-16.51; P17-05 1.27,-13.97; P17-06 1.27,-11.43; P17-07 1.27,-8.89; P17-08 1.27,-6.35; P17-09 1.27,-3.81; P17-10 1.27,-1.27; P17-11 1.27,1.27; P17-12 1.27,3.81; P17-13 1.27,6.35; P17-14 1.27,8.89; P17-15 1.27,11.43; P17-16 1.27,13.97; P17-17 1.27,16.51; P17-18 1.27,19.05; P17-19 1.27,21.59; P17-20 1.27,24.13; P17-21 1.27,26.67; P17-22 1.27,29.21; P18-01 3.81,-24.13; P18-02 3.81,-21.59; P18-03 3.81,-19.05; P18-04 3.81,-16.51; P18-05 3.81,-13.97; P18-06 3.81,-11.43; P18-07 3.81,-8.89; P18-08 3.81,-6.35; P18-09 3.81,-3.81; P18-10 3.81,-1.27; P18-11 3.81,1.27; P18-12 3.81,3.81; P18-13 3.81,6.35; P18-14 3.81,8.89; P18-15 3.81,11.43; P18-16 3.81,13.97; P18-17 3.81,16.51; P18-18 3.81,19.05; P18-19 3.81,21.59; P18-20 3.81,24.13; P18-21 3.81,26.67; P18-22 3.81,29.21; P19-01 6.35,-24.13; P19-02 6.35,-21.59; P19-03 6.35,-19.05; P19-04 6.35,-16.51; P19-05 6.35,-13.97; P19-06 6.35,-11.43; P19-07 6.35,-8.89; P19-08 6.35,-6.35; P19-09 6.35,-3.81; P19-10 6.35,-1.27; P19-11 6.35,1.27; P19-12 6.35,3.81; P19-13 6.35,6.35; P19-14 6.35,8.89; P19-15 6.35,11.43; P19-16 6.35,13.97; P19-17 6.35,16.51; P19-18 6.35,19.05; P19-19 6.35,21.59; P19-20 6.35,24.13; P19-21 6.35,26.67; P19-22 6.35,29.21; P20-01 8.89,-24.13; P20-02 8.89,-21.59; P20-03 8.89,-19.05; P20-04 8.89,-16.51; P20-05 8.89,-13.97; P20-06 8.89,-11.43; P20-07 8.89,-8.89; P20-08 8.89,-6.35; P20-09 8.89,-3.81; P20-10 8.89,-1.27; P20-11 8.89,1.27; P20-12 8.89,3.81; P20-13 8.89,6.35; P20-14 8.89,8.89; P20-15 8.89,11.43; P20-16 8.89,13.97; P20-17 8.89,16.51; P20-18 8.89,19.05; P20-19 8.89,21.59; P20-20 8.89,24.13; P20-21 8.89,26.67; P20-22 8.89,29.21; P21-01 11.43,-24.13; P21-02 11.43,-21.59; P21-03 11.43,-19.05; P21-04 11.43,-16.51; P21-05 11.43,-13.97; P21-06 11.43,-11.43; P21-07 11.43,-8.89; P21-08 11.43,-6.35; P21-09 11.43,-3.81; P21-10 11.43,-1.27; P21-11 11.43,1.27; P21-12 11.43,3.81; P21-13 11.43,6.35; P21-14 11.43,8.89; P21-15 11.43,11.43; P21-16 11.43,13.97; P21-17 11.43,16.51; P21-18 11.43,19.05; P21-19 11.43,21.59; P21-20 11.43,24.13; P21-21 11.43,26.67; P21-22 11.43,29.21; P22-01 13.97,-24.13; P22-02 13.97,-21.59; P22-03 13.97,-19.05; P22-04 13.97,-16.51; P22-05 13.97,-13.97; P22-06 13.97,-11.43; P22-07 13.97,-8.89; P22-08 13.97,-6.35; P22-09 13.97,-3.81; P22-10 13.97,-1.27; P22-11 13.97,1.27; P22-12 13.97,3.81; P22-13 13.97,6.35; P22-14 13.97,8.89; P22-15 13.97,11.43; P22-16 13.97,13.97; P22-17 13.97,16.51; P22-18 13.97,19.05; P22-19 13.97,21.59; P22-20 13.97,24.13; P22-21 13.97,26.67; P22-22 13.97,29.21; P23-01 16.51,-24.13; P23-02 16.51,-21.59; P23-03 16.51,-19.05; P23-04 16.51,-16.51; P23-05 16.51,-13.97; P23-06 16.51,-11.43; P23-07 16.51,-8.89; P23-08 16.51,-6.35; P23-09 16.51,-3.81; P23-10 16.51,-1.27; P23-11 16.51,1.27; P23-12 16.51,3.81; P23-13 16.51,6.35; P23-14 16.51,8.89; P23-15 16.51,11.43; P23-16 16.51,13.97; P23-17 16.51,16.51; P23-18 16.51,19.05; P23-19 16.51,21.59; P23-20 16.51,24.13; P23-21 16.51,26.67; P23-22 16.51,29.21; P24-01 19.05,-24.13; P24-02 19.05,-21.59; P24-03 19.05,-19.05; P24-04 19.05,-16.51; P24-05 19.05,-13.97; P24-06 19.05,-11.43; P24-07 19.05,-8.89; P24-08 19.05,-6.35; P24-09 19.05,-3.81; P24-10 19.05,-1.27; P24-11 19.05,1.27; P24-12 19.05,3.81; P24-13 19.05,6.35; P24-14 19.05,8.89; P24-15 19.05,11.43; P24-16 19.05,13.97; P24-17 19.05,16.51; P24-18 19.05,19.05; P24-19 19.05,21.59; P24-20 19.05,24.13; P24-21 19.05,26.67; P24-22 19.05,29.21; P25-01 21.59,-24.13; P25-02 21.59,-21.59; P25-03 21.59,-19.05; P25-04 21.59,-16.51; P25-05 21.59,-13.97; P25-06 21.59,-11.43; P25-07 21.59,-8.89; P25-08 21.59,-6.35; P25-09 21.59,-3.81; P25-10 21.59,-1.27; P25-11 21.59,1.27; P25-12 21.59,3.81; P25-13 21.59,6.35; P25-14 21.59,8.89; P25-15 21.59,11.43; P25-16 21.59,13.97; P25-17 21.59,16.51; P25-18 21.59,19.05; P25-19 21.59,21.59; P25-20 21.59,24.13; P25-21 21.59,26.67; P25-22 21.59,29.21; P26-01 24.13,-24.13; P26-04 24.13,-16.51; P26-05 24.13,-13.97; P26-06 24.13,-11.43; P26-07 24.13,-8.89; P26-08 24.13,-6.35; P26-09 24.13,-3.81; P26-10 24.13,-1.27; P26-11 24.13,1.27; P26-12 24.13,3.81; P26-13 24.13,6.35; P26-14 24.13,8.89; P26-15 24.13,11.43; P26-16 24.13,13.97; P26-17 24.13,16.51; P26-18 24.13,19.05; P26-19 24.13,21.59; P26-22 24.13,29.21; P27-01 26.67,-24.13; P27-04 26.67,-16.51; P27-05 26.67,-13.97; P27-06 26.67,-11.43; P27-07 26.67,-8.89; P27-08 26.67,-6.35; P27-09 26.67,-3.81; P27-10 26.67,-1.27; P27-11 26.67,1.27; P27-12 26.67,3.81; P27-13 26.67,6.35; P27-14 26.67,8.89; P27-15 26.67,11.43; P27-16 26.67,13.97; P27-17 26.67,16.51; P27-18 26.67,19.05; P27-19 26.67,21.59; P27-22 26.67,29.21; P28-03 29.21,-19.05; P28-04 29.21,-16.51; P28-05 29.21,-13.97; P28-06 29.21,-11.43; P28-07 29.21,-8.89; P28-08 29.21,-6.35; P28-09 29.21,-3.81; P28-10 29.21,-1.27; P28-11 29.21,1.27; P28-12 29.21,3.81; P28-13 29.21,6.35; P28-14 29.21,8.89; P28-15 29.21,11.43; P28-16 29.21,13.97; P28-17 29.21,16.51; P28-18 29.21,19.05; P29-03 31.75,-19.05; P29-04 31.75,-16.51; P29-05 31.75,-13.97; P29-06 31.75,-11.43; P29-07 31.75,-8.89; P29-08 31.75,-6.35; P29-09 31.75,-3.81; P29-12 31.75,3.81; P29-13 31.75,6.35; P29-14 31.75,8.89; P29-15 31.75,11.43; P29-16 31.75,13.97; P29-17 31.75,16.51; P29-18 31.75,19.05; P30-03 34.29,-19.05; P30-04 34.29,-16.51; P30-05 34.29,-13.97; P30-06 34.29,-11.43; P30-07 34.29,-8.89; P30-08 34.29,-6.35; P30-09 34.29,-3.81; P30-10 34.29,-1.27; P30-11 34.29,1.27; P30-12 34.29,3.81; P30-13 34.29,6.35; P30-14 34.29,8.89; P30-15 34.29,11.43; P30-16 34.29,13.97; P30-17 34.29,16.51; P30-18 34.29,19.05; P30-19 34.29,21.59; P31-05 36.83,-13.97; P31-06 36.83,-11.43; P31-07 36.83,-8.89; P31-08 36.83,-6.35; P31-09 36.83,-3.81; P31-10 36.83,-1.27; P31-11 36.83,1.27; P31-12 36.83,3.81; P31-13 36.83,6.35; P31-14 36.83,8.89; P31-15 36.83,11.43; P31-17 36.83,16.51; P31-18 36.83,19.05; P32-05 39.37,-13.97; P32-06 39.37,-11.43; P32-07 39.37,-8.89; P32-08 39.37,-6.35; P32-09 39.37,-3.81; P32-10 39.37,-1.27; P32-11 39.37,1.27; P32-12 39.37,3.81; P32-13 39.37,6.35; P32-14 39.37,8.89; P32-18 39.37,19.05; P33-05 41.91,-13.97; P33-06 41.91,-11.43; P33-07 41.91,-8.89; P33-08 41.91,-6.35; P33-09 41.91,-3.81; P33-10 41.91,-1.27; P33-13 41.91,6.35; P33-14 41.91,8.89; P33-15 41.91,11.43; P33-16 41.91,13.97; P33-17 41.91,16.51; P33-18 41.91,19.05; P34-05 44.45,-13.97; P34-06 44.45,-11.43; P34-07 44.45,-8.89; P34-08 44.45,-6.35; P34-09 44.45,-3.81; P34-10 44.45,-1.27; P34-13 44.45,6.35; P34-14 44.45,8.89; P34-15 44.45,11.43; P34-16 44.45,13.97; P34-17 44.45,16.51; P34-18 44.45,19.05

### Placement (x,y rotation side)
B1  44.5,48.82 0 top
B2  44.5,39.93 0 top
P1  41.96,25.96 0 top

### Tracks (layer width: path | path; a pad name or v marks a point on that pad's centre or on a via)
GND
  pour Top (isolate 0.406): -1.98,58.98 -1.98,-1.98 91.11,-1.98 91.11,58.98
N$1
  Top 0.61: P1.P10-21 P1.P10-22
N$2
  Top 0.61: P1.P11-21 P1.P11-22
N$3
  Top 0.61: P1.P12-21 P1.P12-22
N$4
  Top 0.61: P1.P13-21 P1.P13-22
N$5
  Top 0.61: P1.P14-21 P1.P14-22
N$6
  Top 0.61: P1.P15-21 P1.P15-22
N$7
  Top 0.61: P1.P16-21 P1.P16-22
N$8
  Top 0.61: P1.P17-21 P1.P17-22
N$9
  Top 0.61: P1.P18-21 P1.P18-22
N$10
  Top 0.61: P1.P19-21 P1.P19-22
N$11
  Top 0.61: P1.P20-21 P1.P20-22
N$12
  Top 0.61: P1.P21-21 P1.P21-22
N$13
  Top 0.61: P1.P22-21 P1.P22-22
N$14
  Top 0.61: P1.P23-21 P1.P23-22
N$15
  Top 0.61: P1.P24-21 P1.P24-22
N$16
  Top 0.61: P1.P25-21 P1.P25-22
VCC
  pour Bottom (isolate 0.406): -0.71,57.71 -0.71,-0.71 89.84,-0.71 89.84,57.71

### Text on the board
tPlace: 10068-PBLPI v1.4 | digitalconcepts.net.au